# EAGLE schematic 555timer (EAGLE 9.6.2)
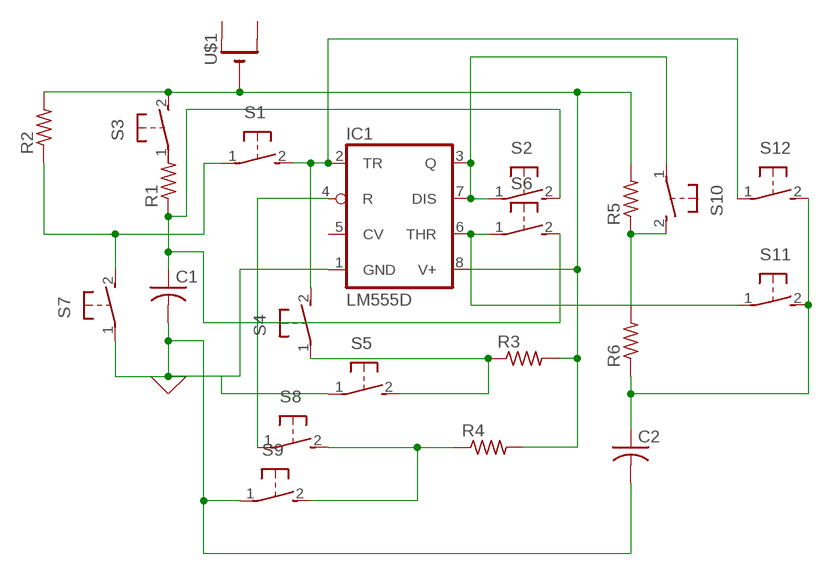
[diagram p0: schematic, sheet 1]

## Parts
C1  C-US025-025X050  [C025-025X050]
C2  C-US025-025X050  [C025-025X050]
IC1  LM555D  [SO08]
R1  R-US_0411/15  [0411/15]
R2  R-US_0411/15  [0411/15]
R3  R-US_0411/15  [0411/15]
R4  R-US_0411/15  [0411/15]
R5  R-US_0411/15  [0411/15]
R6  R-US_0411/15  [0411/15]
S1  31-XX  [B3F-31XX]
S2  31-XX  [B3F-31XX]
S3  31-XX  [B3F-31XX]
S4  31-XX  [B3F-31XX]
S5  31-XX  [B3F-31XX]
S6  31-XX  [B3F-31XX]
S7  31-XX  [B3F-31XX]
S8  31-XX  [B3F-31XX]
S9  31-XX  [B3F-31XX]
S10  31-XX  [B3F-31XX]
S11  31-XX  [B3F-31XX]
S12  31-XX  [B3F-31XX]
U$1  CR1220SMT  [CR1220-SMD]

## Nets
N$1: C1.1 R1.1 S2.2(S) S6.2(S)
N$2: C1.2 C2.2 IC1.1(GND) S5.1(P) S7.1(P) S9.1(P) ; supply symbol labelled GND
N$3: IC1.3(Q) IC1.7(DIS) S2.1(P) S10.1(P)
N$4: IC1.2(TR) S1.2(S) S4.2(S) S12.1(P)
N$5: IC1.6(THR) S6.1(P) S11.1(P)
N$6: R3.1 S4.1(P) S5.2(S)
N$7: R2.1 S1.1(P) S7.2(S)
N$8: IC1.4(R) S8.1(P)
N$9: R4.1 S8.2(S) S9.2(S)
N$10: IC1.8(V+) R2.2 R3.2 R4.2 R5.2 S3.2(S) U$1.-
N$11: R5.1 R6.2 S10.2(S)
N$13: C2.1 R6.1 S11.2(S) S12.2(S)
Unconnected: IC1.5(CV) R1.2 S3.1(P) U$1.+$1(+) U$1.+$2(+1)

## Library data of the parts
C1 C2 = adafruit:C-US: CAPACITOR, American symbol
IC1 = adafruit:*555: TIMER Changed DIP package to have round (not oval) pin pads http://www.ladyada.net/library/pcb/eaglelibrary.html
R1-R6 = adafruit:R-US_: RESISTOR, American symbol
S1-S12 = adafruit:31-XX: OMRON SWITCH Now with beefier pads!
U$1 = adafruit:CR1220: CR1216/CR1220/CR1225 12mm 3V lithium coin cell Great for battery packup. Both SMT and THM holders. Note the THM package has the ground pads on both sides of the PCB so that the masks are the same - this reduces the cost